# Altium schematic sheet APM9328_MEMORY.SchDoc: MEMORIES
size A4; Author: NC; Revision: 1.0; SheetNumber: 4; SheetTotal: 14
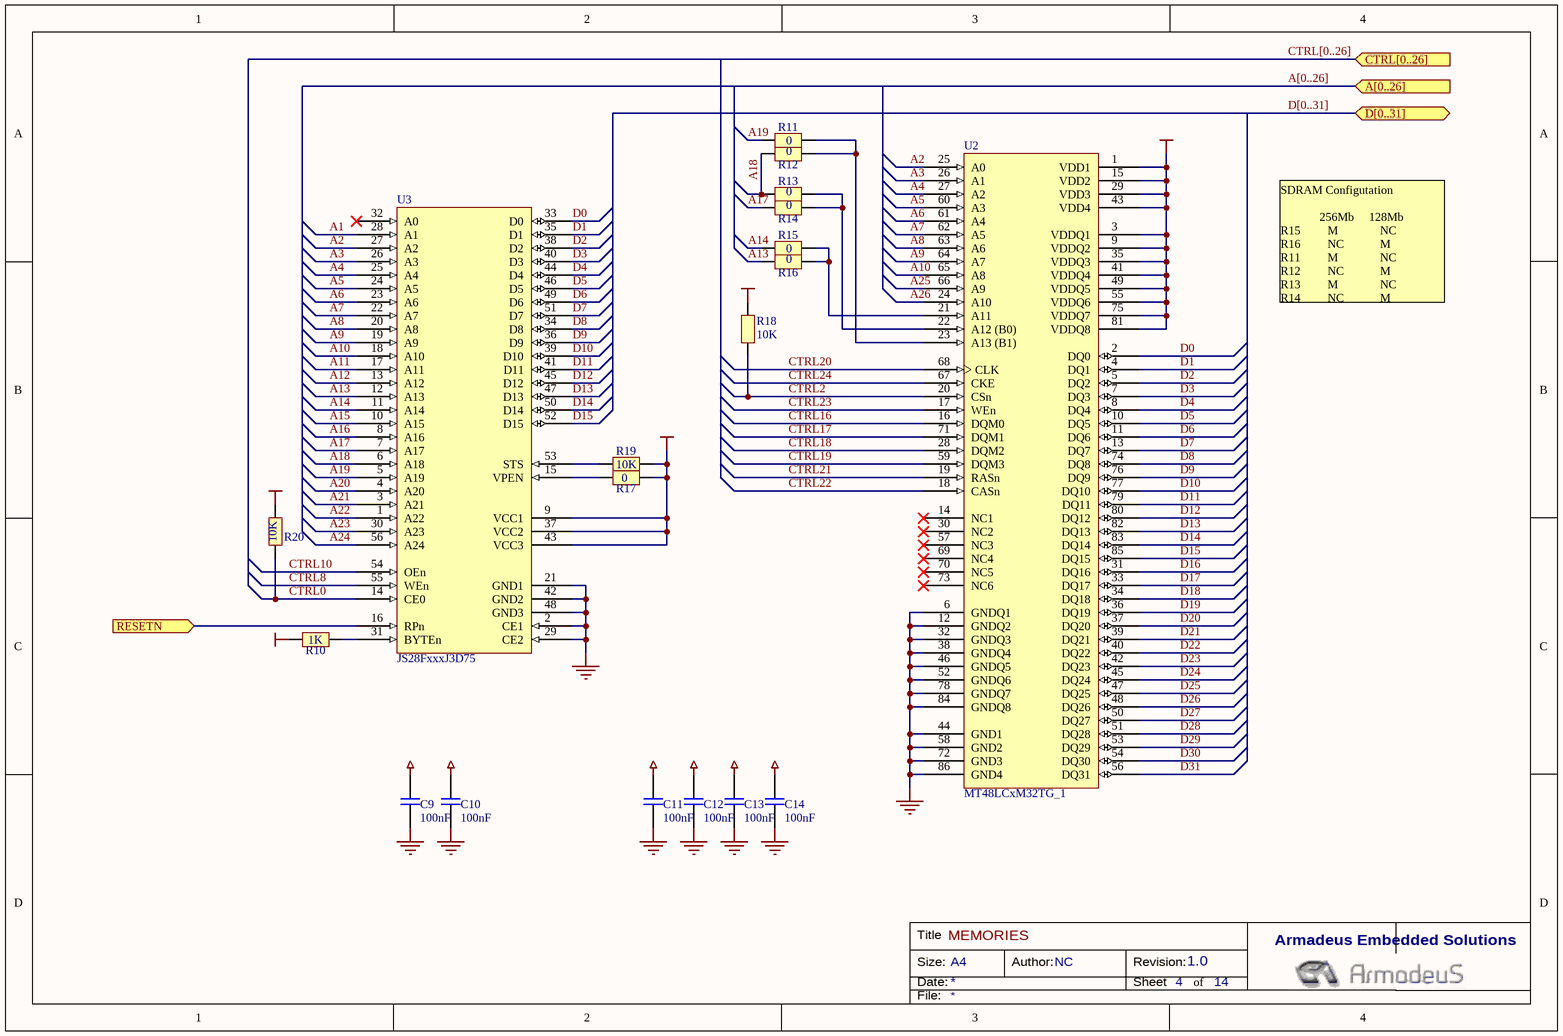
[diagram p0: APM9328_MEMORY.SchDoc]

## Parts
C9  100nF  [0402]
C10  100nF  [0402]
C11  100nF  [0402]
C12  100nF  [0402]
C13  100nF  [0402]
C14  100nF  [0402]
R10  1K  [0402]
R11  0  [0402]
R12  0  [0402]
R13  0  [0402]
R14  0  [0402]
R15  0  [0402]
R16  0  [0402]
R17  0  [0402]
R18  10K  [0402]
R19  10K  [0402]
R20  10K  [0402]
U2  MT48LCxM32TG_1  [TSOP86-400]
U3  JS28FxxxJ3D75  [TSOP56]

## Ports
A[0..26] (in), CTRL[0..26] (in), D[0..31] (bidir), RESETN (in)

## Nets
+3V3: C9.2 C10.2 C11.2 C12.2 C13.2 C14.2 R10.1 R17.2 R18.2 R19.2 R20.2 U2.1(VDD1) U2.3(VDDQ1) U2.9(VDDQ2) U2.15(VDD2) U2.29(VDD3) U2.35(VDDQ3) U2.41(VDDQ4) U2.43(VDD4) U2.49(VDDQ5) U2.55(VDDQ6) U2.75(VDDQ7) U2.81(VDDQ8) U3.9(VCC1) U3.37(VCC2) U3.43(VCC3)
GND: C9.1 C10.1 C11.1 C12.1 C13.1 C14.1 U2.6(GNDQ1) U2.12(GNDQ2) U2.32(GNDQ3) U2.38(GNDQ4) U2.44(GND1) U2.46(GNDQ5) U2.52(GNDQ6) U2.58(GND2) U2.72(GND3) U2.78(GNDQ7) U2.84(GNDQ8) U2.86(GND4) U3.2(CE1) U3.21(GND1) U3.29(CE2) U3.42(GND2) U3.48(GND3)
A1: U3.28(A1)
A2: U2.25(A0) U3.27(A2)
A3: U2.26(A1) U3.26(A3)
A4: U2.27(A2) U3.25(A4)
A5: U2.60(A3) U3.24(A5)
A6: U2.61(A4) U3.23(A6)
A7: U2.62(A5) U3.22(A7)
A8: U2.63(A6) U3.20(A8)
A9: U2.64(A7) U3.19(A9)
A10: U2.65(A8) U3.18(A10)
A11: U3.17(A11)
A12: U3.13(A12)
A13: R16.1 U3.12(A13)
A14: R15.1 U3.11(A14)
A15: U3.10(A15)
A16: U3.8(A16)
A17: R14.1 U3.7(A17)
A18: R12.1 R13.1 U3.6(A18)
A19: R11.1 U3.5(A19)
A20: U3.4(A20)
A21: U3.3(A21)
A22: U3.1(A22)
A23: U3.30(A23)
A24: U3.56(A24)
A25: U2.66(A9)
A26: U2.24(A10)
CTRL0: R20.1 U3.14(CE0)
CTRL2: R18.1 U2.20(CSn)
CTRL8: U3.55(WEn)
CTRL10: U3.54(OEn)
CTRL16: U2.16(DQM0)
CTRL17: U2.71(DQM1)
CTRL18: U2.28(DQM2)
CTRL19: U2.59(DQM3)
CTRL20: U2.68(CLK)
CTRL21: U2.19(RASn)
CTRL22: U2.18(CASn)
CTRL23: U2.17(WEn)
CTRL24: U2.67(CKE)
D0: U2.2(DQ0) U3.33(D0)
D1: U2.4(DQ1) U3.35(D1)
D2: U2.5(DQ2) U3.38(D2)
D3: U2.7(DQ3) U3.40(D3)
D4: U2.8(DQ4) U3.44(D4)
D5: U2.10(DQ5) U3.46(D5)
D6: U2.11(DQ6) U3.49(D6)
D7: U2.13(DQ7) U3.51(D7)
D8: U2.74(DQ8) U3.34(D8)
D9: U2.76(DQ9) U3.36(D9)
D10: U2.77(DQ10) U3.39(D10)
D11: U2.79(DQ11) U3.41(D11)
D12: U2.80(DQ12) U3.45(D12)
D13: U2.82(DQ13) U3.47(D13)
D14: U2.83(DQ14) U3.50(D14)
D15: U2.85(DQ15) U3.52(D15)
D16: U2.31(DQ16)
D17: U2.33(DQ17)
D18: U2.34(DQ18)
D19: U2.36(DQ19)
D20: U2.37(DQ20)
D21: U2.39(DQ21)
D22: U2.40(DQ22)
D23: U2.42(DQ23)
D24: U2.45(DQ24)
D25: U2.47(DQ25)
D26: U2.48(DQ26)
D27: U2.50(DQ27)
D28: U2.51(DQ28)
D29: U2.53(DQ29)
D30: U2.54(DQ30)
D31: U2.56(DQ31)
RESETN: U3.16(RPn) ; port RESETN
NetR10_2: R10.2 U3.31(BYTEn)
NetR11_2: R11.2 R12.2 U2.23(A13_(B1))
NetR13_2: R13.2 R14.2 U2.22(A12_(B0))
NetR15_2: R15.2 R16.2 U2.21(A11)
NetR17_1: R17.1 U3.15(VPEN)
NetR19_1: R19.1 U3.53(STS)

Not connected (* = marked no-connect by the designer): U2 14(NC1)* 30(NC2)* 57(NC3)* 69(NC4)* 70(NC5)* 73(NC6)*; U3 32(A0)*

## Buses and harness runs
bus A[0..26] = port A[0..26]
bus CTRL[0..26] = port CTRL[0..26]
bus D[0..31] = port D[0..31]

## Notes on the sheet
- SDRAM Configutation
  256Mb     128Mb
  R15         M              NC
  R16         NC            M
  R11         M              NC
  R12         NC            M
  R13         M              NC
  R14         NC            M
- Title
- Size:
- Date:
- A4
- Author:
- Revision:
- Sheet
- of
- Armadeus Embedded Solutions
- File:

## Library data of the parts
C9-C14 = Cap
R10-R20 = Res
  R11-R16: Assembly Option: *
U2 = MT48LCxM32TG_1: SDRAM Memory; Manufacturer: Micron; Part Number: MT48LC8M32B2TG-6:GTR; Part Number (S16): MT48LC4M32TG-6:GTR; Part Number (S08): MT48LC2M32TG-6:GTR; Assembly Option: S32; Distributor: Digikey; Price_100: 12,35; Price_500: 11,68; Price_1000: 11,4; Price_100 (S16): 6,385; Price_500 (S16): 6,00; Price_1000 (S16): 5,88; Price_100 (S08): 3,93; Price_500 (S08): 3,69; Price_1000 (S08): 3,614
U3 = MT28FxxxJ3RG: FLASH Memory; Manufacturer: Intel; Part Number: JS28F128J3D75; Part Number (F08): JS28F640J3D75; Part Number (F04): JS28F320J3D75; Assembly Option: F16; Distributor: Digikey; Price_100: 9,945; Price_500: 9,3713; Price_1000: 9,18; Price_100 (F08): 4,39; Price_500 (F08): 4,125; Price_1000 (F08): 4,04; Price_100 (F04): 2,53; Price_500 (F04): 2,38; Price_1000 (F04): 2,33